# Altium project LED_YouTube.PrjPcb
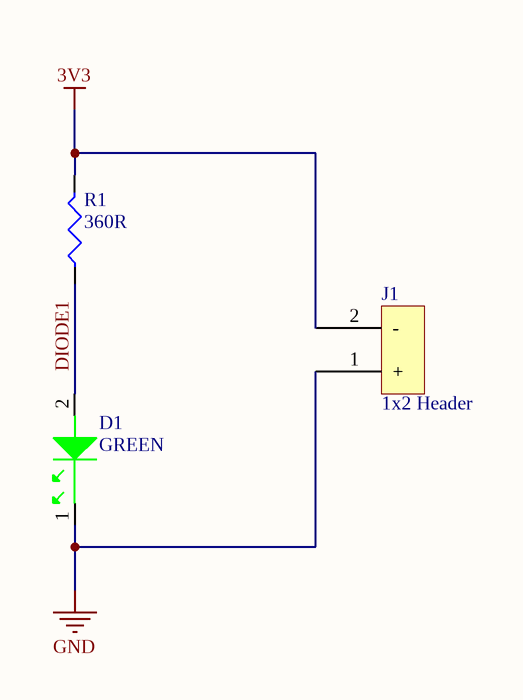
[diagram p0: LED.SchDoc]
1 sheet, 3 parts. Net scope: global (net labels, ports and power ports of the same name join across sheets).
Board file: LED.PcbDoc

## Sheet LED.SchDoc
size A; SheetNumber: 1; SheetTotal: 1

### Parts
D1  GREEN  [LED0603GREEN]
J1  1x2 Header  [HEADER1x2]
R1  360R  [R0805]

### Nets
3V3: J1.2(-) R1.2
GND: D1.1 J1.1(+)
DIODE1: D1.2 R1.1

### Library data of the parts
D1 = LSM0603453V: LED Uni-Color Green 571nm 2-Pin Chip 0603(1608Metric) T/R; Manufacturer: Visual Communications; Lens Color: Colorless; Lens Style: Flat; Lens Transparency: Clear; Luminous Intensity: 63mcd; Forward Voltage: 2V; Test Current: 20mA; Viewing Angle: 120°; Dominant Wavelength: 572nm; Lens Size: 0.8mm; Supplier 1: Digi-Key; Manufacturer Part Number: LSM0603453V; RoHS: Yes; Category: LEDs; Stock 1: 90796; Pricing 1: 1=0.40000, 10=0.24700, 100=0.14210, 1000=0.11124, 2000=0.10197 (USD); Mount: Surface Mount; Case/Package: 0603; Color: Green; Case Code (Imperial): 0603; Case Code (Metric): 1608; Packaging: Cut Tape; Length: 1.6mm; Width: 0.8mm; Height: 0.65mm; RoHS Compliant: Yes; ComponentLink1URL: http://www.farnell.com/datasheets/2699708.pdf?src-supplier=Farnell; ComponentLink1Description: http://www.farnell.com/datasheets/2699708.pdf?src-supplier=Farnell; ComponentLink2URL: http://www.farnell.com/datasheets/2699708.pdf?src-supplier=Newark; ComponentLink2Description: http://www.farnell.com/datasheets/2699708.pdf?src-supplier=Newark; ComponentLink3URL: https://vcclite.com/wp-content/uploads/wpallimport/files/files/LSM0603453V.pdf?src-supplier=Digi-Key; ComponentLink3Description: https://vcclite.com/wp-content/uploads/wpallimport/files/files/LSM0603453V.pdf?src-supplier=Digi-Key; Supplier Part Number 1: LSM0603453VCT-ND
J1 = 61300211121: CONN HEADER 2 POS 2.54; Manufacturer: Wurth Electronics; Current Rating: 3A; Voltage Rating: 250V; Number of Positions: 2; Gender: Male; Connector Type: Male Pin; Pitch: 0.1inch; Supplier 1: Digi-Key; Manufacturer Part Number: 61300211121; RoHS: Yes; Category: Headers and Wire Housings; Stock 1: 164929; Pricing 1: 1=0.13000, 10=0.11300, 25=0.09400, 50=0.07900, 100=0.07100, 1000=0.06500 (USD); Mount: Through Hole; Contact Plating: Gold; Housing Material: PBT; Contact Material: Copper Alloy,Copper; Color: Black; Min Operating Temperature: -40°C; Max Operating Temperature: 125°C; Number of Rows: 1; Contact Gender: Male; Packaging: Bulk; Termination: Through Hole; Number of Contacts: 2; Series: WR-PHD; Contact Type: Male Pin; Contact Mating Length: 0.236inch; Lead Free: Lead Free; RoHS Compliant: Yes; ComponentLink1URL: https://datasheet.ciiva.com/13619/6130xx11121-48870-13619345.pdf?src-supplier=Mouser; ComponentLink1Description: https://datasheet.ciiva.com/13619/6130xx11121-48870-13619345.pdf?src-supplier=Mouser; Supplier Part Number 1: 732-5315-ND
R1 = RC0805FR-07360RL: Res Thick Film 0805 360 Ohm 1% 0.125W(1/8W) ±100ppm/C Pad SMD T/R; Manufacturer: Yageo; Power Rating: 125mW; Voltage Rating: 150V; Temperature Coefficient: 100ppm/°C; Supplier 1: Future Electronics; Manufacturer Part Number: RC0805FR-07360RL; RoHS: Yes; Category: Chip SMD Resistors; Stock 1: 40000; Pricing 1: 5000=0.00270, 25000=0.00250, 125000=0.00230, 375000=0.00220, 1000000=0.00210 (USD); Mount: Surface Mount; Case/Package: 0805; Case Code (Imperial): 0805; Case Code (Metric): 2012; Size Code: 0805; Min Operating Temperature: -55°C; Max Operating Temperature: 155°C; Resistance: 360R; Tolerance: 1%; Packaging: Tape and Reel; Termination: SMD/SMT; Voltage Rating (DC): 150V; Features: Moisture Resistant; Series: RC; Max Power Dissipation: 125mW; Number of Terminations: 2; Technology: THICK FILM; Length: 2mm; Height: 0.5mm; Depth: 1.25mm; Lead Free: Lead Free; RoHS Compliant: Yes; ComponentLink1URL: https://datasheet.ciiva.com/11808/0900766b8106beab-11808261.pdf?src-supplier=Rs; ComponentLink1Description: https://datasheet.ciiva.com/11808/0900766b8106beab-11808261.pdf?src-supplier=Rs; ComponentLink2URL: https://datasheet.ciiva.com/17423/rc0805-17423149.pdf?src-supplier=Future+Electronics; ComponentLink2Description: https://datasheet.ciiva.com/17423/rc0805-17423149.pdf?src-supplier=Future+Electronics; ComponentLink3URL: https://datasheet.ciiva.com/12667/rc0805-12667401.pdf?src-supplier=Mouser; ComponentLink3Description: https://datasheet.ciiva.com/12667/rc0805-12667401.pdf?src-supplier=Mouser; Supplier Part Number 1: 1029238